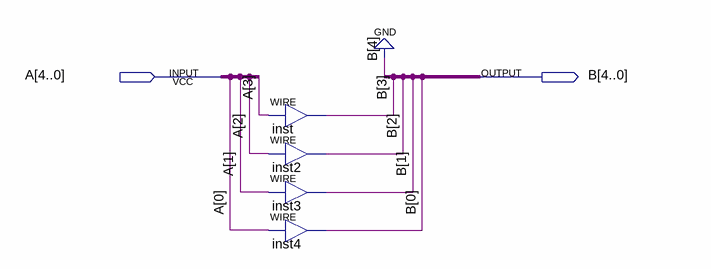
[diagram p0: schematic sheet]
// Quartus schematic modulo.bdf as structural Verilog: 4 symbols, 2 pins
module modulo (
  input  [4:0] A,
  output [4:0] B
);

  assign B[3] = A[3];  // WIRE inst
  assign B[2] = A[2];  // WIRE inst2
  assign B[1] = A[1];  // WIRE inst3
  assign B[0] = A[0];  // WIRE inst4

  assign B[4] = 1'b0;
endmodule
